# EAGLE design BreakoutTRRS-V0-2 (EAGLE 7.5.0)
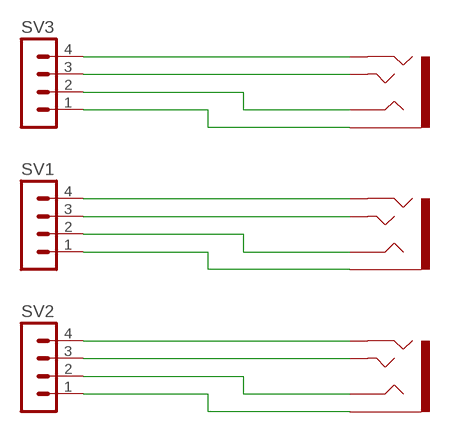
[diagram p0: schematic, sheet 1]

## Parts
SV1  MA04-1  [MA04-1]
SV2  MA04-1  [MA04-1]
SV3  MA04-1  [MA04-1]
TO-HEADSET1  AUDIO-JACK3  [AUDIO-JACK-TRRS-SMD]
TO-HEADSET2  AUDIO-JACK3  [AUDIO-JACK-TRRS-SMD]
TO-HEADSET3  AUDIO-JACK3  [AUDIO-JACK-TRRS-SMD]

## Nets
GND: SV2.4 TO-HEADSET1.RING2
GND1: SV1.4 TO-HEADSET2.RING2
GND2: SV3.4 TO-HEADSET3.RING2
N$1: SV1.1 TO-HEADSET2.EARTH
N$2: SV1.3 TO-HEADSET2.TIP
N$3: SV1.2 TO-HEADSET2.RING1
N$4: SV3.1 TO-HEADSET3.EARTH
N$5: SV3.3 TO-HEADSET3.TIP
N$6: SV3.2 TO-HEADSET3.RING1
N$7: SV2.1 TO-HEADSET1.EARTH
N$8: SV2.3 TO-HEADSET1.TIP
N$9: SV2.2 TO-HEADSET1.RING1

## Library data of the parts
SV1-SV3 = con-lstb:MA04-1: PIN HEADER; OC_FARNELL: unknown; OC_NEWARK: unknown
TO-HEADSET1-TO-HEADSET3 = SparkFun-Connectors:AUDIO-JACK3: Audio jack - 3.5mm TRRS variety - two rings.

## Net classes
0 default: width 0.6 mm

## Board
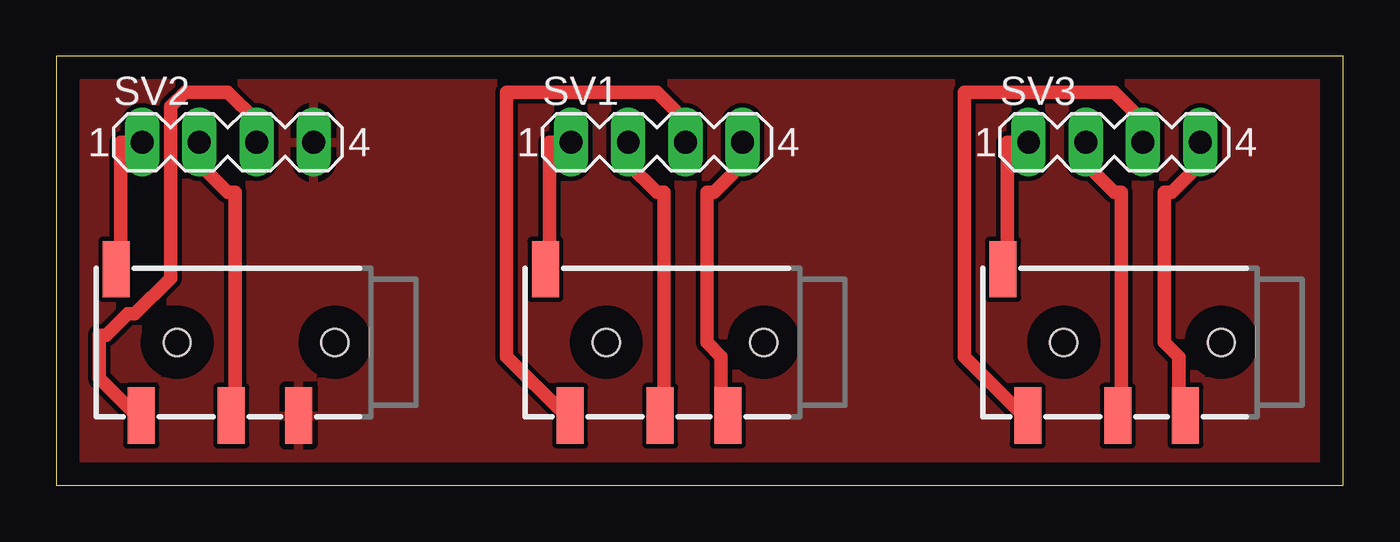
[diagram p1: board, top side]

Size 57.15 x 19.05 mm. Coordinates in mm from the lower left corner, seen from the top.
Outline: 0,0 57.15,0 57.15,19.05 0,19.05 0,0
Copper layers (1*16): Top 0.035mm / dielectric 1.5mm / Bottom 0.035mm
Design rules "default": minimum track width 10mil, minimum drill 24mil, track to track 8mil, track to pad 8mil, pad to pad 8mil, via to via 8mil, smd to smd 8mil, copper to edge 40mil, drill to drill 8mil, minimum pad ring 10mil, minimum via ring 8mil, stop-mask expansion 4mil, vias tented up to drill 0mil, thermal gap 10mil

### Footprints (pad centres in the part's own frame; a part is rotated, then mirrored left to right if it is on the bottom)
MA04-1 = drill 1.016 long: 1 -3.81,0; 2 -1.27,0; 3 1.27,0; 4 3.81,0
AUDIO-JACK-TRRS-SMD = smd 1.2 x 2.5: EARTH 11.3,-3.25; RING1 6.2,3.25; RING2 3.2,3.25; TIP 10.2,3.25 | hole 1.2: 1.6,0; 8.6,0

### Placement (x,y rotation side)
SV1  26.67,15.24 0 top
SV2  7.62,15.24 0 top
SV3  46.99,15.24 0 top
TO-HEADSET1  13.97,6.35 180 top
TO-HEADSET2  33.02,6.35 180 top
TO-HEADSET3  53.34,6.35 180 top

### Tracks (layer width: path | path; a pad name or v marks a point on that pad's centre or on a via)
GND
  pour Top: 57.15,0 57.15,19.05 0,19.05 0,0
GND1
  Top 0.6: SV1.4 30.48,14.29 29.21,13.02 28.89,13.02 28.89,6.35 29.53,5.71 29.53,3.17 TO-HEADSET2.RING2
GND2
  Top 0.6: SV3.4 50.8,14.29 49.53,13.02 49.21,13.02 49.21,6.35 49.85,5.71 49.85,3.17 TO-HEADSET3.RING2
N$1
  Top 0.6: SV1.1 21.91,15.24 21.91,9.84 TO-HEADSET2.EARTH
N$2
  Top 0.6: SV1.3 27.94,16.19 26.67,17.46 20,17.46 20,5.71 22.54,3.17 TO-HEADSET2.TIP
N$3
  Top 0.6: SV1.2 25.4,14.29 26.67,13.02 26.99,13.02 26.99,3.17 TO-HEADSET2.RING1
N$4
  Top 0.6: SV3.1 42.23,15.24 42.23,9.84 TO-HEADSET3.EARTH
N$5
  Top 0.6: SV3.3 48.26,16.19 46.99,17.46 40.32,17.46 40.32,5.71 42.86,3.17 TO-HEADSET3.TIP
N$6
  Top 0.6: SV3.2 45.72,14.29 46.99,13.02 47.31,13.02 47.31,3.17 TO-HEADSET3.RING1
N$7
  Top 0.6: SV2.1 2.86,15.24 2.86,9.84 TO-HEADSET1.EARTH
N$8
  Top 0.6: SV2.3 8.89,16.19 7.62,17.46 5.71,17.46 5.08,16.83 5.08,9.21 3.49,7.62 3.17,7.62 2.22,6.67 1.91,6.67 1.91,4.76 3.49,3.17 TO-HEADSET1.TIP
N$9
  Top 0.6: SV2.2 6.35,14.29 7.62,13.02 7.94,13.02 7.94,3.17 TO-HEADSET1.RING1